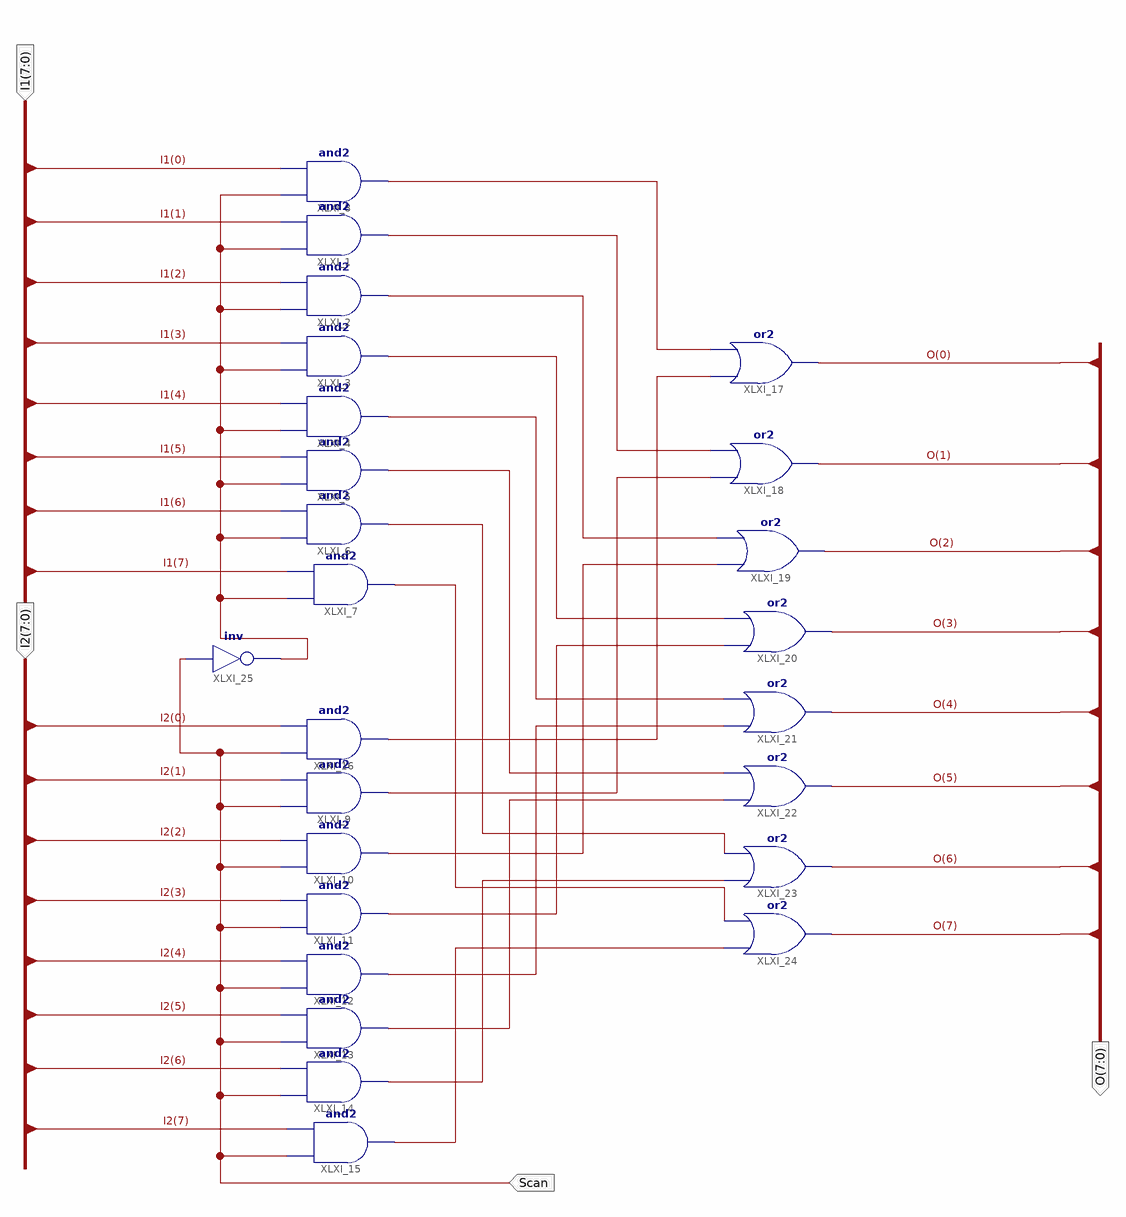
[diagram p0: schematic sheet 1]
// Xilinx ISE schematic MUX2T1_8.sch (kintex7) as structural Verilog: 25 symbols, 4 ports
module MUX2T1_8 (
  input  [7:0] I1,
  input  [7:0] I2,
  input  Scan,
  output [7:0] O
);

  wire XLXN_11, XLXN_36, XLXN_39, XLXN_40, XLXN_41, XLXN_42, XLXN_43, XLXN_44, XLXN_45, XLXN_46, XLXN_47,
       XLXN_48, XLXN_49, XLXN_50, XLXN_51, XLXN_52, XLXN_53;

  and XLXI_8 (XLXN_36, XLXN_11, I1[0]);
  and XLXI_7 (XLXN_49, XLXN_11, I1[7]);
  and XLXI_6 (XLXN_48, XLXN_11, I1[6]);
  and XLXI_5 (XLXN_47, XLXN_11, I1[5]);
  and XLXI_4 (XLXN_46, XLXN_11, I1[4]);
  and XLXI_3 (XLXN_44, XLXN_11, I1[3]);
  and XLXI_2 (XLXN_42, XLXN_11, I1[2]);
  and XLXI_1 (XLXN_40, XLXN_11, I1[1]);
  and XLXI_9 (XLXN_41, Scan, I2[1]);
  and XLXI_10 (XLXN_43, Scan, I2[2]);
  and XLXI_11 (XLXN_45, Scan, I2[3]);
  and XLXI_12 (XLXN_50, Scan, I2[4]);
  and XLXI_13 (XLXN_51, Scan, I2[5]);
  and XLXI_14 (XLXN_52, Scan, I2[6]);
  and XLXI_15 (XLXN_53, Scan, I2[7]);
  and XLXI_16 (XLXN_39, Scan, I2[0]);
  or XLXI_17 (O[0], XLXN_39, XLXN_36);
  or XLXI_18 (O[1], XLXN_41, XLXN_40);
  or XLXI_19 (O[2], XLXN_43, XLXN_42);
  or XLXI_20 (O[3], XLXN_45, XLXN_44);
  or XLXI_21 (O[4], XLXN_50, XLXN_46);
  or XLXI_22 (O[5], XLXN_51, XLXN_47);
  or XLXI_23 (O[6], XLXN_52, XLXN_48);
  or XLXI_24 (O[7], XLXN_53, XLXN_49);
  not XLXI_25 (XLXN_11, Scan);
endmodule
